# EAGLE design MainsLog-Main (EAGLE 5.11)
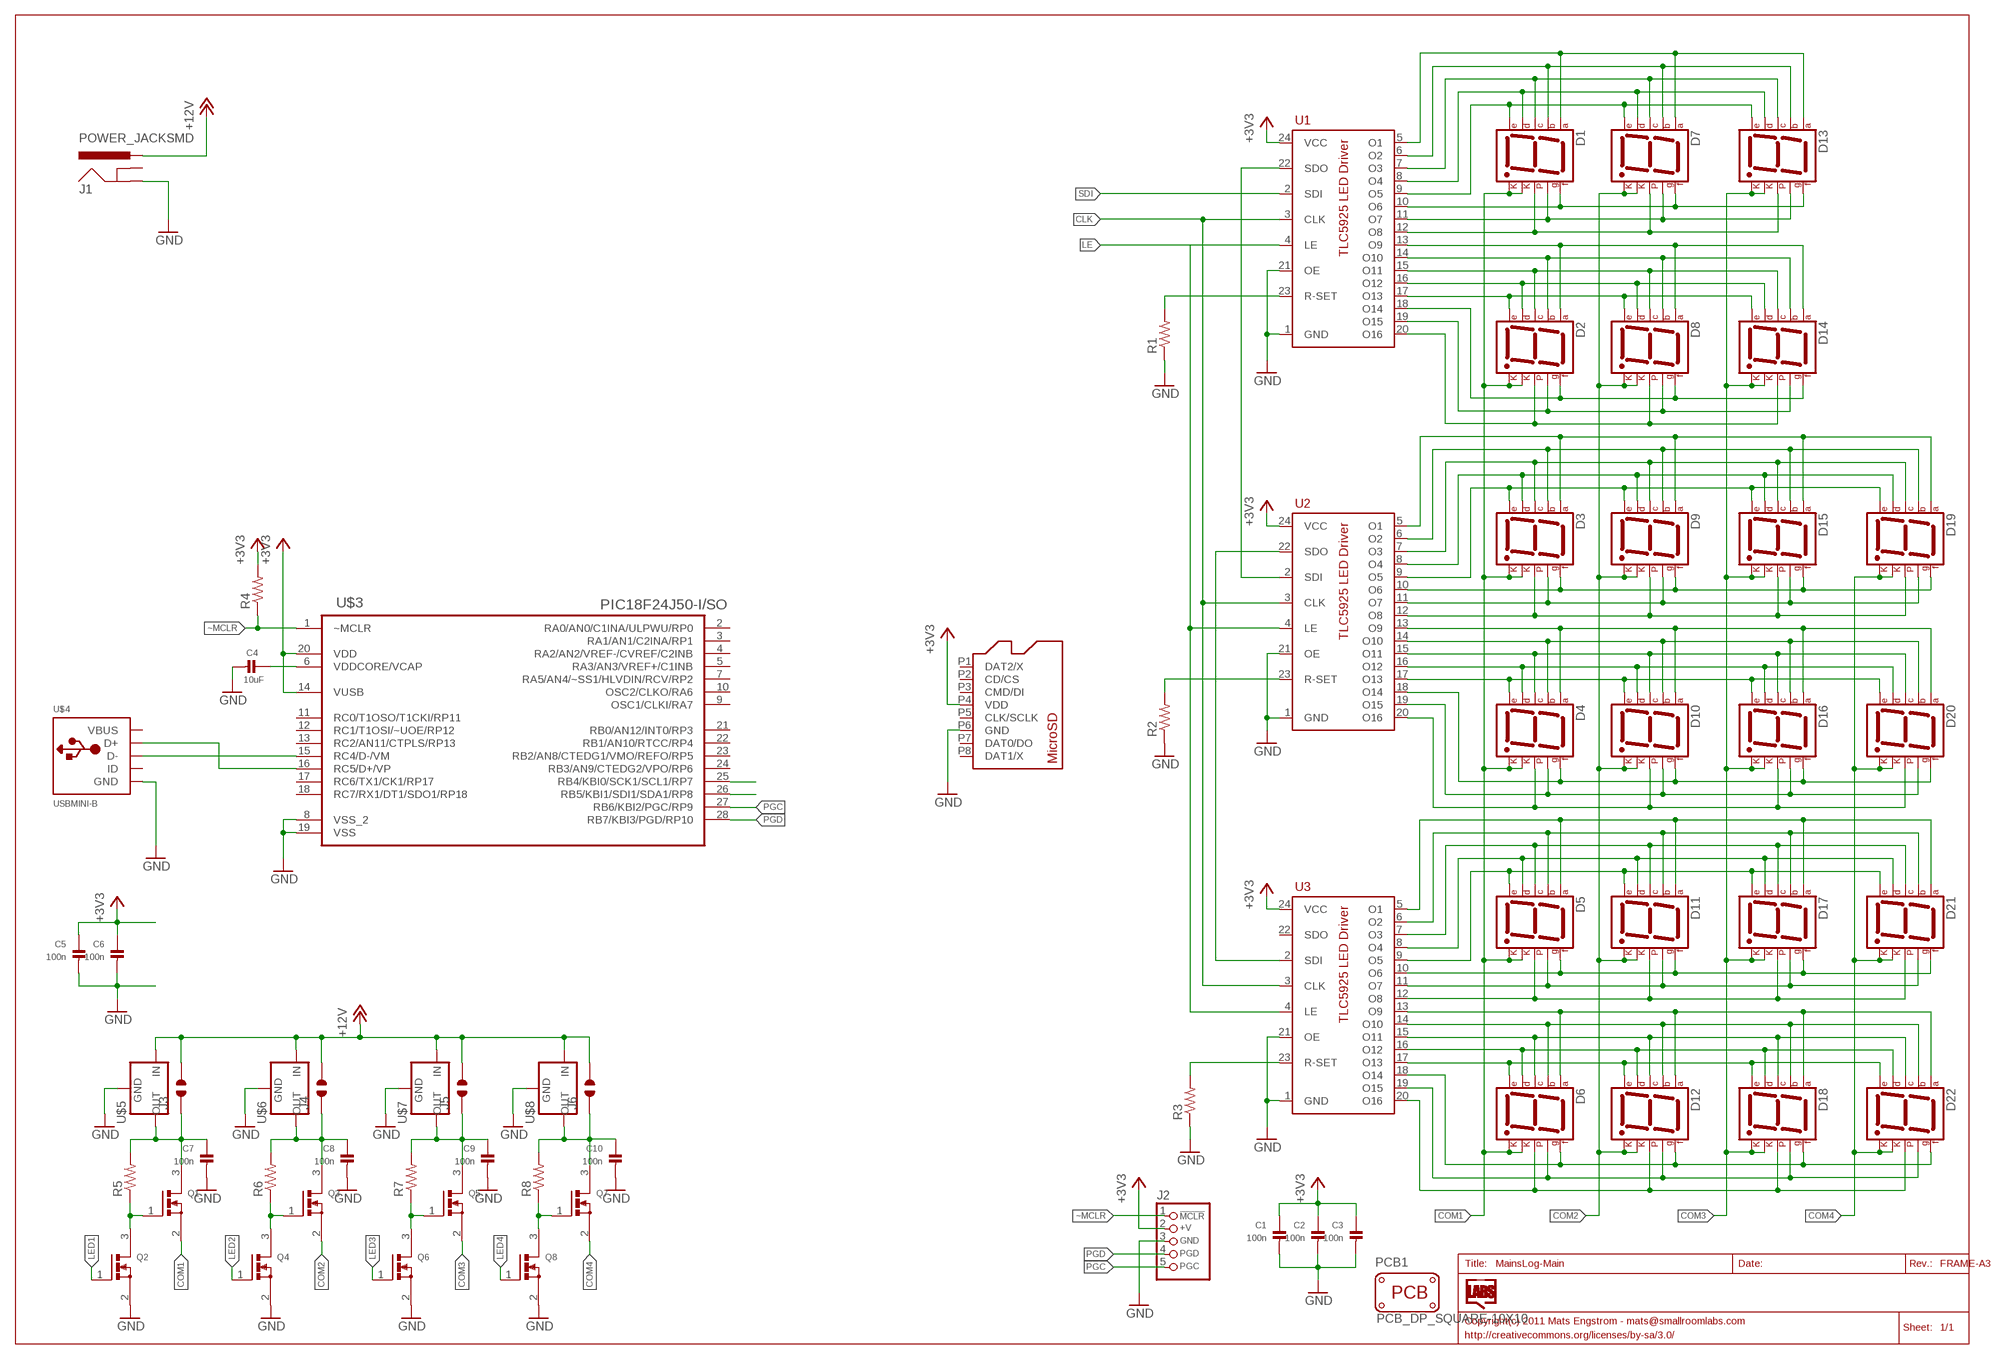
[diagram p0: schematic, sheet 1]

## Parts
C1  100n  CAP_CERAMIC0805  [0805]
C2  100n  CAP_CERAMIC0805  [0805]
C3  100n  CAP_CERAMIC0805  [0805]
C4  10uF  CAP_CERAMIC0805  [0805]
C5  100n  CAP_CERAMIC0805  [0805]
C6  100n  CAP_CERAMIC0805  [0805]
C7  100n  CAP_CERAMIC0805  [0805]
C8  100n  CAP_CERAMIC0805  [0805]
C9  100n  CAP_CERAMIC0805  [0805]
C10  100n  CAP_CERAMIC0805  [0805]
D1  7SEG-CK  [7SEG-13]
D2  7SEG-CK  [7SEG-13]
D3  7SEG-CK  [7SEG-13]
D4  7SEG-CK  [7SEG-13]
D5  7SEG-CK  [7SEG-13]
D6  7SEG-CK  [7SEG-13]
D7  7SEG-CK  [7SEG-13]
D8  7SEG-CK  [7SEG-13]
D9  7SEG-CK  [7SEG-13]
D10  7SEG-CK  [7SEG-13]
D11  7SEG-CK  [7SEG-13]
D12  7SEG-CK  [7SEG-13]
D13  7SEG-CK  [7SEG-13]
D14  7SEG-CK  [7SEG-13]
D15  7SEG-CK  [7SEG-13]
D16  7SEG-CK  [7SEG-13]
D17  7SEG-CK  [7SEG-13]
D18  7SEG-CK  [7SEG-13]
D19  7SEG-CK  [7SEG-13]
D20  7SEG-CK  [7SEG-13]
D21  7SEG-CK  [7SEG-13]
D22  7SEG-CK  [7SEG-13]
J1  POWER_JACKSMD  [POWER_JACK_SMD]
J2  CON_HEADER_PRG_PIC_ICSPB  [HEADER_PRG_1X05_ICSP_B]
J3  JUMPER_SOLDER_1X2  [JUMPER_SOLDER_1X2]
J4  JUMPER_SOLDER_1X2  [JUMPER_SOLDER_1X2]
J5  JUMPER_SOLDER_1X2  [JUMPER_SOLDER_1X2]
J6  JUMPER_SOLDER_1X2  [JUMPER_SOLDER_1X2]
PCB1  PCB_DP_SQUARE-10X10  [PCB10X10]
Q1  MOSFET-NREFLOW  [SOT23-R]
Q2  MOSFET-NREFLOW  [SOT23-R]
Q3  MOSFET-NREFLOW  [SOT23-R]
Q4  MOSFET-NREFLOW  [SOT23-R]
Q5  MOSFET-NREFLOW  [SOT23-R]
Q6  MOSFET-NREFLOW  [SOT23-R]
Q7  MOSFET-NREFLOW  [SOT23-R]
Q8  MOSFET-NREFLOW  [SOT23-R]
R1  RES0805A  [R0805A]
R2  RES0805A  [R0805A]
R3  RES0805A  [R0805A]
R4  10K  RES0805A  [R0805A]
R5  10K  RES0805A  [R0805A]
R6  10K  RES0805A  [R0805A]
R7  10K  RES0805A  [R0805A]
R8  10K  RES0805A  [R0805A]
U1  TLC5925-TSSOP  [TSSOP24]
U2  TLC5925-TSSOP  [TSSOP24]
U3  TLC5925-TSSOP  [TSSOP24]
U$2  MICROSD-DM3D  [DM3D]
U$3  PIC18F24J50-I/SO  [SOIC127P1030X265-28N]
U$4  USBMINI-B  [MOLEX67503]
U$5  V_REG_MIC2920  [SOT223]
U$6  V_REG_MIC2920  [SOT223]
U$7  V_REG_MIC2920  [SOT223]
U$8  V_REG_MIC2920  [SOT223]

## Nets
+3V3: C1.1 C2.1 C3.1 C5.1 C6.1 J2.2(+V) R4.2 U1.24(VCC) U2.24(VCC) U3.24(VCC) U$2.P4(VDD) U$3.14(VUSB) U$3.20(VDD)
+12V: J1.VIN0(PWR) J3.2 J4.2 J5.2 J6.2 U$5.1(IN) U$6.1(IN) U$7.1(IN) U$8.1(IN)
CLK: U1.3(CLK) U2.3(CLK) U3.3(CLK)
COM1: D1.3(CK1) D1.8(CK2) D2.3(CK1) D2.8(CK2) D3.3(CK1) D3.8(CK2) D4.3(CK1) D4.8(CK2) D5.3(CK1) D5.8(CK2) D6.3(CK1) D6.8(CK2) Q1.2(S)
COM2: D7.3(CK1) D7.8(CK2) D8.3(CK1) D8.8(CK2) D9.3(CK1) D9.8(CK2) D10.3(CK1) D10.8(CK2) D11.3(CK1) D11.8(CK2) D12.3(CK1) D12.8(CK2) Q3.2(S)
COM3: D13.3(CK1) D13.8(CK2) D14.3(CK1) D14.8(CK2) D15.3(CK1) D15.8(CK2) D16.3(CK1) D16.8(CK2) D17.3(CK1) D17.8(CK2) D18.3(CK1) D18.8(CK2) Q5.2(S)
COM4: D19.3(CK1) D19.8(CK2) D20.3(CK1) D20.8(CK2) D21.3(CK1) D21.8(CK2) D22.3(CK1) D22.8(CK2) Q7.2(S)
GND: C1.2 C2.2 C3.2 C4.2 C5.2 C6.2 C7.2 C8.2 C9.2 C10.2 J1.P$4(GND) J2.3(GND) Q2.2(S) Q4.2(S) Q6.2(S) Q8.2(S) R1.1 R2.1 R3.1 U1.1(GND) U1.21(OE) U2.1(GND) U2.21(OE) U3.1(GND) U3.21(OE) U$2.P6(GND) U$3.8(VSS_2) U$3.19(VSS) U$4.GND U$5.2(GND) U$6.2(GND) U$7.2(GND) U$8.2(GND)
LE: U1.4(LE) U2.4(LE) U3.4(LE)
LED1: Q2.1(G)
LED2: Q4.1(G)
LED3: Q6.1(G)
LED4: Q8.1(G)
N$1: Q1.1(G) Q2.3(D) R5.1
N$2: C10.1 J6.1 Q7.3(D) R8.2 U$8.3(OUT)
N$3: U1.22(SDO) U2.2(SDI)
N$4: U2.22(SDO) U3.2(SDI)
N$5: U$3.15(RC4/D-/VM) U$4.D-
N$6: U$3.16(RC5/D+/VP) U$4.D+
N$7: R3.2 U3.23(R-SET)
N$8: R2.2 U2.23(R-SET)
N$9: R1.2 U1.23(R-SET)
N$10: U$3.25(RB4/KBI0/SCK1/SCL1/RP7)
N$11: U$3.26(RB5/KBI1/SDI1/SDA1/RP8)
N$12: C8.1 J4.1 Q3.3(D) R6.2 U$6.3(OUT)
N$13: C4.1 U$3.6(VDDCORE/VCAP)
N$16: C9.1 J5.1 Q5.3(D) R7.2 U$7.3(OUT)
N$17: C7.1 J3.1 Q1.3(D) R5.2 U$5.3(OUT)
N$18: Q3.1(G) Q4.3(D) R6.1
N$19: Q5.1(G) Q6.3(D) R7.1
N$20: Q7.1(G) Q8.3(D) R8.1
PGC: J2.5(PGC) U$3.27(RB6/KBI2/PGC/RP9)
PGD: J2.4(PGD) U$3.28(RB7/KBI3/PGD/RP10)
SDI: U1.2(SDI)
SEG-A1: D1.7(A) D7.7(A) D13.7(A) U1.5(O1)
SEG-A2: D2.7(A) D8.7(A) D14.7(A) U1.13(O9)
SEG-A3: D3.7(A) D9.7(A) D15.7(A) D19.7(A) U2.5(O1)
SEG-A4: D4.7(A) D10.7(A) D16.7(A) D20.7(A) U2.13(O9)
SEG-A5: D5.7(A) D11.7(A) D17.7(A) D21.7(A) U3.5(O1)
SEG-A6: D6.7(A) D12.7(A) D18.7(A) D22.7(A) U3.13(O9)
SEG-B1: D1.6(B) D7.6(B) D13.6(B) U1.6(O2)
SEG-B2: D2.6(B) D8.6(B) D14.6(B) U1.14(O10)
SEG-B3: D3.6(B) D9.6(B) D15.6(B) D19.6(B) U2.6(O2)
SEG-B4: D4.6(B) D10.6(B) D16.6(B) D20.6(B) U2.14(O10)
SEG-B5: D5.6(B) D11.6(B) D17.6(B) D21.6(B) U3.6(O2)
SEG-B6: D6.6(B) D12.6(B) D18.6(B) D22.6(B) U3.14(O10)
SEG-C1: D1.4(C) D7.4(C) D13.4(C) U1.7(O3)
SEG-C2: D2.4(C) D8.4(C) D14.4(C) U1.15(O11)
SEG-C3: D3.4(C) D9.4(C) D15.4(C) D19.4(C) U2.7(O3)
SEG-C4: D4.4(C) D10.4(C) D16.4(C) D20.4(C) U2.15(O11)
SEG-C5: D5.4(C) D11.4(C) D17.4(C) D21.4(C) U3.7(O3)
SEG-C6: D6.4(C) D12.4(C) D18.4(C) D22.4(C) U3.15(O11)
SEG-D1: D1.2(D) D7.2(D) D13.2(D) U1.8(O4)
SEG-D2: D2.2(D) D8.2(D) D14.2(D) U1.16(O12)
SEG-D3: D3.2(D) D9.2(D) D15.2(D) D19.2(D) U2.8(O4)
SEG-D4: D4.2(D) D10.2(D) D16.2(D) D20.2(D) U2.16(O12)
SEG-D5: D5.2(D) D11.2(D) D17.2(D) D21.2(D) U3.8(O4)
SEG-D6: D6.2(D) D12.2(D) D18.2(D) D22.2(D) U3.16(O12)
SEG-E1: D1.1(E) D7.1(E) D13.1(E) U1.9(O5)
SEG-E2: D2.1(E) D8.1(E) D14.1(E) U1.17(O13)
SEG-E3: D3.1(E) D9.1(E) D15.1(E) D19.1(E) U2.9(O5)
SEG-E4: D4.1(E) D10.1(E) D16.1(E) D20.1(E) U2.17(O13)
SEG-E5: D5.1(E) D11.1(E) D17.1(E) D21.1(E) U3.9(O5)
SEG-E6: D6.1(E) D12.1(E) D18.1(E) D22.1(E) U3.17(O13)
SEG-F1: D1.9(F) D7.9(F) D13.9(F) U1.10(O6)
SEG-F2: D2.9(F) D8.9(F) D14.9(F) U1.18(O14)
SEG-F3: D3.9(F) D9.9(F) D15.9(F) D19.9(F) U2.10(O6)
SEG-F4: D4.9(F) D10.9(F) D16.9(F) D20.9(F) U2.18(O14)
SEG-F5: D5.9(F) D11.9(F) D17.9(F) D21.9(F) U3.10(O6)
SEG-F6: D6.9(F) D12.9(F) D18.9(F) D22.9(F) U3.18(O14)
SEG-G1: D1.10(G) D7.10(G) D13.10(G) U1.11(O7)
SEG-G2: D2.10(G) D8.10(G) D14.10(G) U1.19(O15)
SEG-G3: D3.10(G) D9.10(G) D15.10(G) D19.10(G) U2.11(O7)
SEG-G4: D4.10(G) D10.10(G) D16.10(G) D20.10(G) U2.19(O15)
SEG-G5: D5.10(G) D11.10(G) D17.10(G) D21.10(G) U3.11(O7)
SEG-G6: D6.10(G) D12.10(G) D18.10(G) D22.10(G) U3.19(O15)
SEG-P1: D1.5(DP) D7.5(DP) D13.5(DP) U1.12(O8)
SEG-P2: D2.5(DP) D8.5(DP) D14.5(DP) U1.20(O16)
SEG-P3: D3.5(DP) D9.5(DP) D15.5(DP) D19.5(DP) U2.12(O8)
SEG-P4: D4.5(DP) D10.5(DP) D16.5(DP) D20.5(DP) U2.20(O16)
SEG-P5: D5.5(DP) D11.5(DP) D17.5(DP) D21.5(DP) U3.12(O8)
SEG-P6: D6.5(DP) D12.5(DP) D18.5(DP) D22.5(DP) U3.20(O16)
~MCLR: J2.1(/MCLR) R4.1 U$3.1(~MCLR)
Unconnected: J1.GND(GNDBREAK) U3.22(SDO) U$2.P1(DAT2/X) U$2.P2(CD/CS) U$2.P3(CMD/DI) U$2.P5(CLK/SCLK) U$2.P7(DAT0/DO) U$2.P8(DAT1/X) U$3.2(RA0/AN0/C1INA/ULPWU/RP0) U$3.3(RA1/AN1/C2INA/RP1) U$3.4(RA2/AN2/VREF-/CVREF/C2INB) U$3.5(RA3/AN3/VREF+/C1INB) U$3.7(RA5/AN4/~SS1/HLVDIN/RCV/RP2) U$3.9(OSC1/CLKI/RA7) U$3.10(OSC2/CLKO/RA6) U$3.11(RC0/T1OSO/T1CKI/RP11) U$3.12(RC1/T1OSI/~UOE/RP12) U$3.13(RC2/AN11/CTPLS/RP13) U$3.17(RC6/TX1/CK1/RP17) U$3.18(RC7/RX1/DT1/SDO1/RP18) U$3.21(RB0/AN12/INT0/RP3) U$3.22(RB1/AN10/RTCC/RP4) U$3.23(RB2/AN8/CTEDG1/VMO/REFO/RP5) U$3.24(RB3/AN9/CTEDG2/VPO/RP6) U$4.ID

## Power pins joined to a net without a drawn wire
VBUS: U$4.VBUS

## Library data of the parts
C1-C10 = microbuilder:CAP_CERAMIC: Ceramic Capacitors 0402 - 0402 Surface Mount Capacitors 0.1uF 10V 10% [Digikey: 490-1318-2-ND] 0603 - 0603 Surface Mount Capacitors 16 pF 50V 5% [Digikey: 445-5051-2-ND] 22 pF 50V [Digikey: PCC220ACVTR-ND] 33 pF 50V 5% [Digikey: 490-1415-1-ND] 56pF 50V 5% [Digikey: 490-1421-1-ND] 220pF 50V 5% [Digikey: 445-1285-1-ND] 680 pF 50V 2200 pF 50V 5% C0G [Digikey: 445-1297-1-ND] 5600 pF 100V 5% X7R [Digikey: 478-3711-1-ND] 0.1 µF 25V 10% [Digikey: PCC2277TR-ND] 0.22 µF 16V 10% X7R [Digikey: 445-1318-1-ND] 1.0 µF 25V 10% [Digikey: 445-5146-2-ND] 0603 - RF Specific 3pF 250V +/-0.1pF RF [Digikey: 712-1347-1-ND] 18 pF 250V 5% [Digikey: 478-3505-1-ND or 712-1322-1-ND] 56 pF 250V 5% C0G RF [Digikey: 490-4867-1-ND] 68 pF 250V RF [Digikey: 490-4868-1-ND] 0805 - 0805 Surface Mount Capacitors 220 pF 250V 2% RF Ceramic Capacitor [Digikey: 712-1398-1-ND] 1000 pF 50V 2% NP0 Ceramic Capacitor [Digikey: 478-3760-1-ND] 0.1 µF 25V 10% Ceramic Capacitor [Digikey: PCC1828TR-ND] 1.0 µF 16V 10% Ceramic Capacitor[Digikey: 490-1691-2-ND] 10.0 µF 10V 10% Ceramic Capacitor[Digikey: 709-1228-1-ND] 1206 - 1206 Surface Mount Capacitors
D1-D22 = special:7SEG-CK: 7-segment DISPLAY single cathode, 13 mm
J1 = SparkFun:POWER_JACK: Power Jack This is the standard 5.5mm barrel jack for power. The PTH is the most common, proven, reliable, footprint. All others are experimental. The Slot footprint only works if the mill layer is transmitted to the PCB fab house so be warned. Spark Fun Electronics SKU : PRT-00119. Mating wall wart : TOL-00298 (and others)
J2 = dp_devices:CON_HEADER_PRG_PIC_ICSP: 5-pin PIC In Circuit Serial Programming header
J3-J6 = dp_devices:JUMPER_SOLDER_1X2
PCB1 = dp_devices:PCB_DP_SQUARE: Dangerous Prototypes Standard Square PCB sizes
Q1-Q8 = microbuilder:MOSFET-N: N-Channel Mosfet Digikey: 2N7002ET1GOSTR-ND
R1-R8 = SmallRoomLabs:RES
U1-U3 = SmallRoomLabs:TLC5925
U$2 = SmallRoomLabs:MICROSD
U$3 = SmallRoomLabs:PIC18F24J50-I/SO: High-Performance Enhanced Flash Microcontrollers; MPN: PIC18F24J50-I/SO; OC_FARNELL: 1778466; OC_NEWARK: 98M1772; PACKAGE: SOIC-28; SUPPLIER: Microchip
U$4 = SmallRoomLabs:USB
U$5-U$8 = SparkFun:V_REG_MIC2920: MIC2920A (http://www.micrel.com/_PDF/mic2920.pdf) - 400mA output LDO Regulator

## Net classes
0 default: width 0.203 mm, drill 0.305 mm, clearance 0.203 mm

## Board
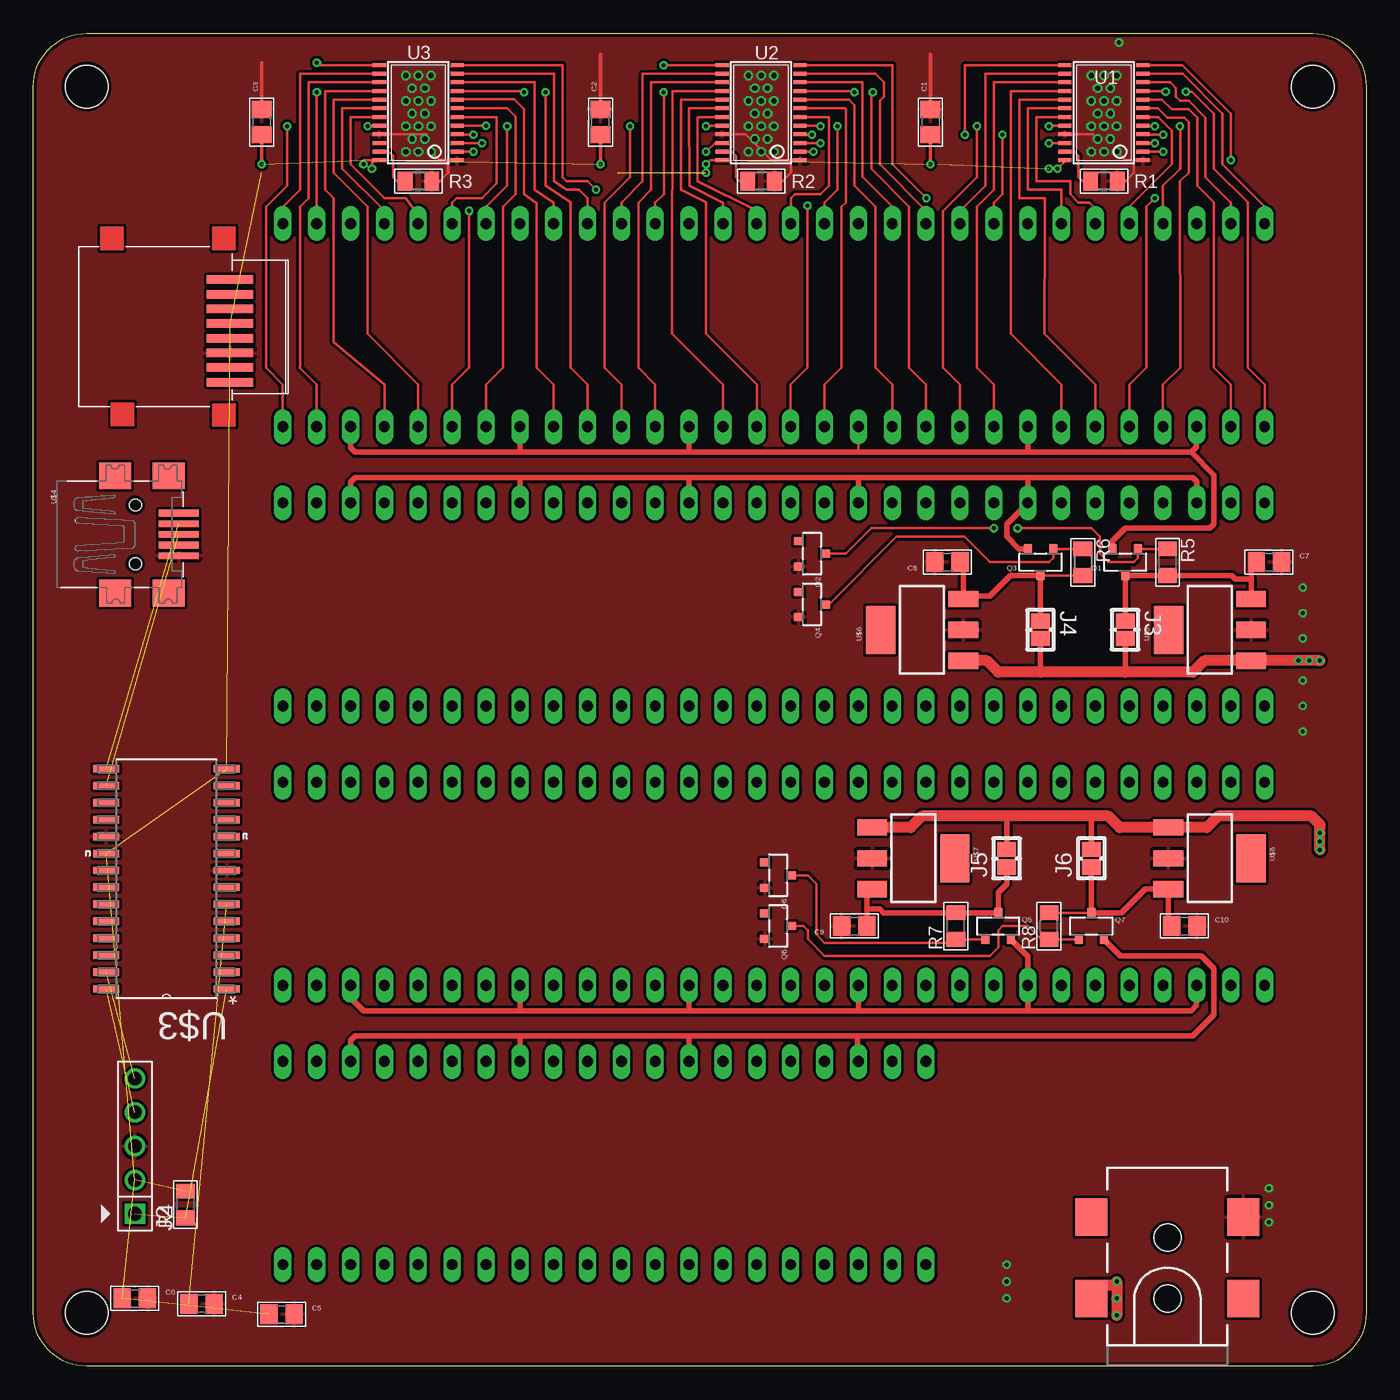
[diagram p1: board, top side]
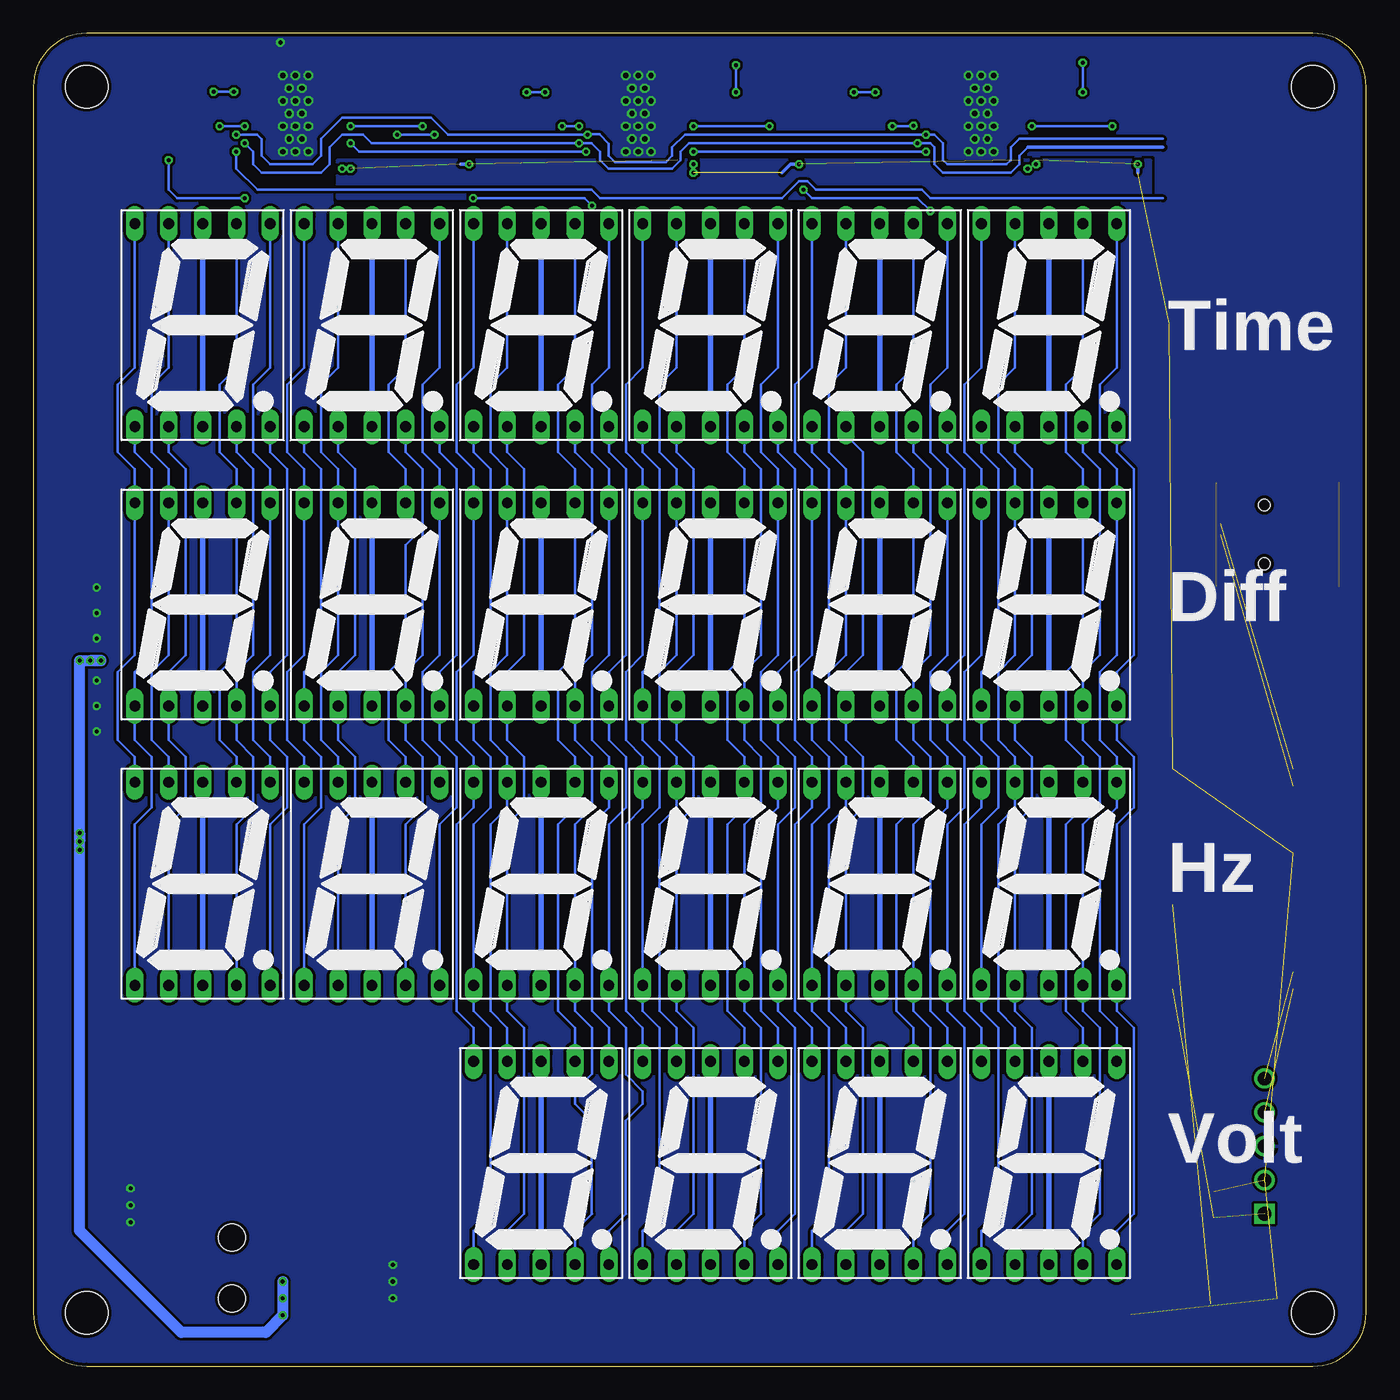
[diagram p2: board, bottom side, seen from below]

Size 100 x 100 mm. Coordinates in mm from the lower left corner, seen from the top.
Copper layers (1*16): Top 0.035mm / dielectric 1.5mm / Bottom 0.035mm
Design rules "Fusion_eagle_rule_v1.1": minimum track width 6mil, minimum drill 12mil, track to track 6mil, track to pad 6mil, pad to pad 6mil, via to via 6mil, smd to smd 0mil, copper to edge 10mil, drill to drill 10mil, minimum pad ring 10mil, minimum via ring 6mil, stop-mask expansion 2mil, vias tented up to drill 100mil, thermal gap 10mil

### Footprints (pad centres in the part's own frame; a part is rotated, then mirrored left to right if it is on the bottom)
0805 = smd 1.3 x 1.5: 1 -0.95,0; 2 0.95,0
7SEG-13 = drill 0.813 long: 1 -5.08,-7.62; 2 -2.54,-7.62; 3 0,-7.62; 4 2.54,-7.62; 5 5.08,-7.62; 6 5.08,7.62; 7 2.54,7.62; 8 0,7.62; 9 -2.54,7.62; 10 -5.08,7.62
POWER_JACK_SMD = smd 2.8 x 2.4: GND 0,-5.7; P$4 6.1,-5.7; VIN0 0,5.7; VIN1 6.1,5.7 | hole 2.032: 0,0; 4.572,0
HEADER_PRG_1X05_ICSP_B = drill 1.016 square: 1 -5.08,0 | drill 1.016 round: 2 -2.54,0; 3 0,0; 4 2.54,0; 5 5.08,0
JUMPER_SOLDER_1X2 = smd 1.143 x 1.422: 1 -0.66,0; 2 0.66,0
PCB10X10 = hole 3.2: 4,4; 96,4; 96,96; 4,96
SOT23-R = smd 0.6 x 0.7: 1 -0.95,-1; 2 0.95,-1; 3 0,1
R0805A = smd 1.1 x 1.4: 1 -1,0; 2 1,0
TSSOP24 = smd 0.305 x 0.991: 1 -3.575,-2.918; 2 -2.925,-2.918; 3 -2.275,-2.918; 4 -1.625,-2.918; 5 -0.975,-2.918; 6 -0.325,-2.918; 7 0.325,-2.918; 8 0.975,-2.918; 9 1.625,-2.918; 10 2.275,-2.918; 11 2.925,-2.918; 12 3.575,-2.918; 13 3.575,2.918; 14 2.925,2.918; 15 2.275,2.918; 16 1.625,2.918; 17 0.975,2.918; 18 0.325,2.918; 19 -0.325,2.918; 20 -0.975,2.918; 21 -1.625,2.918; 22 -2.275,2.918; 23 -2.925,2.918; 24 -3.575,2.918
DM3D = smd 0.635 x 3.5: P1 9.544,0.168; P2 8.444,0.168; P3 7.344,0.168; P4 6.244,0.168; P5 5.144,0.168; P6 4.044,0.168; P7 2.944,0.168; P8 1.844,0.168
SOIC127P1030X265-28N = smd 1.981 x 0.559: 1 -4.521,8.255; 2 -4.521,6.985; 3 -4.521,5.715; 4 -4.521,4.445; 5 -4.521,3.175; 6 -4.521,1.905; 7 -4.521,0.635; 8 -4.521,-0.635; 9 -4.521,-1.905; 10 -4.521,-3.175; 11 -4.521,-4.445; 12 -4.521,-5.715; 13 -4.521,-6.985; 14 -4.521,-8.255; 15 4.521,-8.255; 16 4.521,-6.985; 17 4.521,-5.715; 18 4.521,-4.445; 19 4.521,-3.175; 20 4.521,-1.905; 21 4.521,-0.635; 22 4.521,0.635; 23 4.521,1.905; 24 4.521,3.175; 25 4.521,4.445; 26 4.521,5.715; 27 4.521,6.985; 28 4.521,8.255
MOLEX67503 = smd 0.5 x 3: D+ 0,3.264; D- -0.8,3.264; GND 1.6,3.264; ID 0.8,3.264; VBUS -1.6,3.264 | smd 2 x 2.4: GND1 -4.4,-1.5; GND2 -4.4,2.5; GND3 4.4,2.5; GND4 4.4,-1.5 | hole 0.9: -2.2,0; 2.2,0
SOT223 = smd 1.219 x 2.235: 1 -2.311,-3.099; 2 0,-3.099; 3 2.311,-3.099 | smd 3.6 x 2.2: 4 0,3.099

### Placement (x,y rotation side)
C1  67.31,93.34 90 top
C2  42.55,93.34 90 top
C3  17.14,93.34 90 top
C4  12.62,4.7 0 top
C5  18.62,3.89 0 top
C6  7.62,5.08 0 top
C7  92.71,60.33 0 top
C8  68.58,60.33 180 top
C9  61.59,33.02 180 top
C10  86.36,33.02 0 top
D1  87.3,78.11 0 bottom
D2  74.6,78.11 0 bottom
D3  61.9,78.11 0 bottom
D4  49.2,78.11 0 bottom
D5  36.5,78.11 0 bottom
D6  23.8,78.11 0 bottom
D7  87.3,57.15 0 bottom
D8  74.6,57.15 0 bottom
D9  61.9,57.15 0 bottom
D10  49.2,57.15 0 bottom
D11  36.5,57.15 0 bottom
D12  23.8,57.15 0 bottom
D13  87.3,36.2 0 bottom
D14  74.6,36.2 0 bottom
D15  61.9,36.2 0 bottom
D16  49.2,36.2 0 bottom
D17  36.5,36.2 0 bottom
D18  23.8,36.2 0 bottom
D19  61.9,15.24 0 bottom
D20  49.2,15.24 0 bottom
D21  36.5,15.24 0 bottom
D22  23.8,15.24 0 bottom
J1  85.09,5.08 90 top
J2  7.62,16.51 90 top
J3  81.92,55.24 270 top
J4  75.56,55.24 270 top
J5  73.03,38.1 90 top
J6  79.38,38.1 90 top
PCB1  100,0 0 bottom
Q1  81.92,60.33 180 top
Q2  58.42,60.96 270 top
Q3  75.56,60.33 180 top
Q4  58.42,57.15 270 top
Q5  72.39,33.02 0 top
Q6  55.88,36.83 270 top
Q7  79.38,33.02 0 top
Q8  55.88,33.02 270 top
R1  80.33,88.9 180 top
R2  54.61,88.9 180 top
R3  28.89,88.9 180 top
R4  11.42,12.13 90 top
R5  85.09,60.33 270 top
R6  78.74,60.33 270 top
R7  69.22,33.02 90 top
R8  76.2,33.02 90 top
U1  80.31,94.04 90 top
U2  54.6,94.04 90 top
U3  28.88,94.04 90 top
U$2  14.92,71.98 90 top
U$3  9.99,36.56 180 top
U$4  7.65,62.41 270 top
U$5  88.27,55.24 90 top
U$6  66.67,55.24 90 top
U$7  66.04,38.1 270 top
U$8  88.27,38.1 270 top
U$9  [SRL-LOGO-BSTOP-10MM]  86.36,8.89 0 top

### Tracks (layer width: path | path; a pad name or v marks a point on that pad's centre or on a via)
+3V3  (via drill 0.3)  (12 unrouted)
  Top 0.203: U3.24 25.42,90.47 25.4,90.45 | 25.4,90.45 v25.4,89.85 | v24.77,90.17 24.77,90.49 25.36,90.49 25.4,90.45 | v50.48,89.53 v50.48,90.17 50.8,90.49 51.66,90.49 U2.24 | U1.24 77.49,90.47 v76.83,89.85 v76.2,89.85
  Top 0.254: v67.31,90.17 C1.1 | v42.55,90.17 C2.1 | v17.14,90.17 C3.1
  Bottom 0.254: v67.31,90.17 67.94,90.17 | v42.55,90.17 43.18,90.17 43.81,89.53 | v17.14,90.17 17.14,89.53
+12V  (via drill 0.3)
  Top 0.406: 81.92,52.07 J3.2 | 75.56,52.07 J4.2 | 79.38,41.27 J6.2 | 73.03,41.27 J5.2
  Top 0.813: U$6.1 71.53,52.93 72.39,52.07 75.56,52.07 81.92,52.07 87,52.07 87.86,52.93 U$5.1 v96.52,52.93 | 62.87,40.49 U$7.1 65.81,40.41 66.67,41.27 73.03,41.27 79.38,41.27 80.64,41.27 81.51,40.41 U$8.1 88.04,40.41 88.9,41.27 95.89,41.27 96.52,40.64 v96.52,40.01 | J1.VIN0 79.38,6.09 81.28,6.09 v81.28,6.35 v81.28,5.08 v81.28,3.81 | v96.52,38.73 v96.52,40.01 | v96.52,40.01 96.52,40.41
  Bottom 0.813: v81.28,6.35 v81.28,3.81 82.55,2.54 88.9,2.54 96.52,10.16 v96.52,38.73 v96.52,39.37 | v96.52,39.37 v96.52,52.93 94.93,52.94 v94.92,52.95 v95.72,52.93 | v96.52,40.01 v96.52,39.37
CLK  (via drill 0.3)
  Top 0.203: U2.3 59.16,91.77 v59.05,91.76 | U3.3 31.81,91.76 v33.66,91.76 | U1.3 84.13,91.77 v84.14,91.76
  Bottom 0.203: v84.14,91.76 83.5,91.12 83.5,90.17 82.87,89.53 78.42,89.53 77.79,90.17 77.79,91.44 76.83,92.39 75.25,92.39 74.61,91.76 v59.05,91.76 58.1,91.76 57.47,91.12 57.47,90.49 56.83,89.85 52.07,89.85 51.44,90.49 51.44,91.12 50.8,91.76 v33.66,91.76 32.7,91.76 32.38,91.44 32.38,90.17 31.75,89.53 26.67,89.53 26.04,90.17 26.04,90.81 25.4,91.44
  Bottom 0.254: 15.24,91.44 25.4,91.44
COM1
  Top 0.203: 87.25,70.43 D1.3 | 74.55,68.58 74.6,68.63 | 36.58,68.58 36.5,68.66 | 61.9,68.58 D3.3
  Top 0.406: 49.2,68.58 36.58,68.58 24.13,68.58 23.8,68.91 D6.3 | 86.87,68.58 74.55,68.58 61.9,68.58 49.2,68.58 | 86.87,68.58 87.25,68.96 87.25,70.43 | 74.6,68.63 D2.3 | 36.5,68.66 D5.3 | 49.2,68.58 D4.3 | 86.87,68.58 88.58,66.86 88.58,63.18 88.27,62.87 81.92,62.87 80.97,61.91 Q1.2
  Bottom 0.406: D6.3 D6.8 | D5.3 D5.8 | D4.3 D4.8 | D3.3 D3.8 | D2.3 D2.8 | D1.3 D1.8
COM2
  Top 0.406: D12.8 23.8,66.34 24.13,66.67 36.5,66.67 | 49.2,66.67 61.9,66.67 | 74.6,66.67 87,66.67 87.3,66.37 D7.8 | 74.6,66.67 D8.8 | 61.9,66.67 D9.8 | 61.9,66.67 74.6,66.67 | 49.2,66.67 D10.8 | 36.5,66.67 D11.8 | 36.5,66.67 49.2,66.67 | D8.8 74.61,64.75 | Q3.2 73.93,61.33 73.03,62.23 73.03,63.2 D8.8
  Bottom 0.406: D12.3 D12.8 | D11.8 D11.3 | D10.8 D10.3 | D9.8 D9.3 | D8.8 D8.3 | D7.8 D7.3
COM3
  Top 0.203: 87.25,28.52 D13.3 | 74.55,26.67 74.6,26.72 | 36.45,26.67 36.5,26.72
  Top 0.406: 49.2,26.67 36.45,26.67 24.77,26.67 23.8,27.64 D18.3 | 87.25,28.52 87.25,27.05 86.87,26.67 74.55,26.67 61.9,26.67 | 74.6,26.72 D14.3 74.6,30.76 Q5.2 | 36.5,26.72 D17.3 | 61.9,26.67 D15.3 | 49.2,26.67 D16.3 | 49.2,26.67 61.9,26.67
  Bottom 0.406: D13.3 D13.8 | D14.3 D14.8 | D15.3 D15.8 | D16.3 D16.8 | D17.3 D17.8 | D18.3 D18.8
COM4
  Top 0.203: 49.28,24.77 49.2,24.69 | 36.58,24.77 36.5,24.69
  Top 0.406: D22.8 23.8,24.43 24.13,24.77 36.58,24.77 49.28,24.77 61.78,24.77 | 61.78,24.77 61.85,24.38 61.85,22.91 D19.8 | 49.2,24.69 D20.8 | 36.5,24.69 D21.8 | Q7.2 81.55,30.8 87.63,30.8 88.58,29.84 88.58,26.35 87,24.77 61.78,24.77
  Bottom 0.406: D22.3 D22.8 | D21.8 D21.3 | D20.8 D20.3 | D19.8 D19.3
GND  (via drill 0.3, 0.4)
  Top 0.203: U2.21 53.43,92.42 55.38,90.47 56.83,90.47 | 56.83,90.47 U2.1 | R2.1 56.2,88.9 56.83,89.53 56.83,90.47 | R3.1 30.48,88.9 31.11,89.53 | 30.5,90.47 v29.84,91.12 | U3.21 29.5,92.42 v29.37,92.08 | U1.21 79.51,92.42 v79.85,92.08 | 82.55,90.47 U1.1 | 82.55,90.47 81.93,90.47 v81.28,91.12 | R1.1 81.92,88.9 82.55,89.53 82.55,90.47
  Top 0.254: C3.2 17.14,97.79 | C2.2 42.55,98.42 | C1.2 67.31,98.42 | 31.11,90.47 30.5,90.47 | 31.11,90.47 U3.1 | 31.11,89.53 31.11,90.47
  other vias: 95.25,51.44 95.25,54.61 95.25,56.52 95.25,58.42 95.25,49.53 81.46,99.31 27.94,96.84 28.89,96.84 29.84,96.84 28.42,95.89 29.37,95.89 29.84,94.93 28.89,94.93 27.94,94.93 28.42,93.98 29.37,93.98 29.84,93.03 28.89,93.03 27.94,93.03 28.42,92.08 28.89,91.12 27.94,91.12 53.66,96.84 54.61,96.84 55.56,96.84 54.13,95.89 55.09,95.89 55.56,94.93 54.61,94.93 53.66,94.93 54.13,93.98 55.09,93.98 55.56,93.03 54.61,93.03 53.66,93.03 54.13,92.08 55.09,92.08 55.56,91.12 54.61,91.12 53.66,91.12 79.38,96.84 80.33,96.84 81.28,96.84 79.85,95.89 80.8,95.89 81.28,94.93 80.33,94.93 79.38,94.93 79.85,93.98 80.8,93.98 81.28,93.03 80.33,93.03 79.38,93.03 80.8,92.08 80.33,91.12 79.38,91.12 95.25,47.62 73.03,7.62 73.03,6.35 73.03,5.08 92.71,10.79 92.71,12.06 92.71,13.34
  pour Top: 100,100 0,100 0,0 100,0
  pour Top: 82.09,90.55 78.54,90.55 78.54,98.62 82.09,98.62
  pour Top: 52.82,90.23 56.38,90.23 56.38,98.62 52.82,98.62
  pour Top: 27.1,90.23 30.66,90.23 30.66,99.57 27.1,99.57
  pour Bottom (rank 2): 0,100 0,0 100,0 100,100 39.37,100.33
LE  (via drill 0.3)
  Top 0.203: U3.4 31.82,92.39 v33.02,92.39 | v84.77,92.39 83.23,92.39 U1.4 | v58.42,92.39 57.54,92.39 U2.4
  Bottom 0.203: v84.77,92.39 83.21,92.39 82.87,92.05 82.87,90.81 82.23,90.17 79.06,90.17 78.42,90.81 78.42,92.08 76.83,93.66 70.17,93.66 68.9,92.39 v58.42,92.39 58.39,92.42 U2.4 56.83,91.74 56.83,90.81 56.36,90.33 52.55,90.33 52.07,90.81 52.07,91.44 51.12,92.39 v33.02,92.39 32.38,92.39 31.75,91.76 31.75,90.49 31.43,90.17 26.99,90.17 26.67,90.49 26.67,91.44 26.04,92.08 15.24,92.08
N$1  (via drill 0.3)
  Top 0.203: R5.1 Q1.1 82.86,60.64 82.55,60.33 80.64,60.33 80.01,60.96 80.01,62.23 79.38,62.87 v73.85,62.87 | v72.07,62.87 62.87,62.87 60.96,60.96 Q2.3
  Bottom 0.203: v72.07,62.87 v73.85,62.87
N$2
  Top 0.203: R8.2 Q7.3
  Top 0.406: J6.1 Q7.3 81.64,34.02 83.41,35.79 U$8.3 85.17,33.26 C10.1
N$3  (via drill 0.3)
  Top 0.203: U2.2 v58.53,91.12 58.42,91.12 | U1.22 76.53,91.77 v76.2,91.76
  Bottom 0.203: v76.2,91.76 75.56,91.12 74.93,91.12 v58.53,91.12
N$4  (via drill 0.3)
  Top 0.203: U3.2 v33.02,91.12 | v50.48,91.12 51.13,91.77 U2.22
  Bottom 0.203: v33.02,91.12 v50.48,91.12
N$5  (1 unrouted)
N$6  (1 unrouted)
N$7
  Top 0.203: U3.23 26.67,91.12 26.99,90.81 26.99,89.22 27.3,88.9 R3.2
N$8
  Top 0.203: U2.23 52.39,91.12 52.7,90.81 52.7,89.22 53.02,88.9 R2.2
N$9
  Top 0.203: U1.23 78.11,91.12 78.42,90.81 78.42,89.22 78.74,88.9 R1.2 79.38,88.9
N$12
  Top 0.203: Q3.3 R6.2 | U$6.3 70,57.78
  Top 0.406: U$6.3 69.77,60.09 C8.1 | 70,57.78 71.75,57.78 73.3,59.33 Q3.3 J4.1
N$13  (1 unrouted)
N$16
  Top 0.406: J5.1 73.03,36.2 72.39,35.56 Q5.3 R7.2 63.77,34.02 63.5,34.29 62.55,34.29 | 62.55,34.29 62.55,35.39 U$7.3 | C9.1 62.55,34.29
N$17
  Top 0.406: 91.36,59.05 U$5.3 | 91.36,59.05 91.36,60.09 C7.1 | 91.36,59.05 90.17,59.05 89.9,59.33 R5.2 Q1.3 J3.1
N$18
  Top 0.203: R6.1 Q3.1 76.52,60.64 76.2,60.33 71.75,60.33 69.85,62.23 64.77,62.23 59.69,57.15 Q4.3
N$19
  Top 0.203: 71.44,32.07 Q5.1 R7.1 68.94,31.75 59.37,31.75 58.74,32.38 58.74,36.2 58.1,36.83 Q6.3
N$20
  Top 0.203: 78.42,32.07 Q7.1 R8.1 75.61,32.02 74.61,33.02 72.71,33.02 72.39,32.7 72.39,31.43 71.75,30.8 59.37,30.8 58.1,32.07 58.1,32.7 57.78,33.02 Q8.3
PGC  (1 unrouted)
PGD  (1 unrouted)
SDI  (via drill 0.3)
  Top 0.203: U1.2 v84.77,91.12
  Bottom 0.203: v84.77,91.12 84.77,89.85 83.19,88.27 58.1,88.27 57.47,87.63 43.81,87.63 42.55,88.9 41.91,88.9 41.27,88.27 33.34,88.27 32.7,87.63 15.24,87.63
SEG-A1  (via drill 0.3)
  Top 0.203: v84.14,93.03 83.23,93.03 U1.5 | D1.7 84.76,88.57 86.04,89.85 86.04,93.02 v86.03,93.03
  Bottom 0.203: D13.7 84.76,45.72 86.03,46.99 86.03,52.07 84.76,53.34 D7.7 84.76,67.31 86.03,68.58 86.03,73.66 84.76,74.93 D1.7 | v86.03,93.03 v84.14,93.03
SEG-A2  (via drill 0.3)
  Top 0.203: U1.13 69.9,97.62 v69.9,92.39 | v72.71,92.39 72.71,87.95 72.07,87.31 72.07,85.74 D2.7
  Bottom 0.203: D14.7 72.06,45.72 73.33,46.99 73.33,52.07 72.06,53.34 72.07,53.35 72.07,61.59 71.44,62.23 71.44,63.5 72.06,64.12 D8.7 72.06,67.31 73.33,68.58 73.33,73.66 72.06,74.93 D2.7 | v72.71,92.39 v69.9,92.39
SEG-A3  (via drill 0.3)
  Top 0.203: U2.5 59.05,93.07 v59.05,93.03 | D3.7 59.37,85.74 59.37,87.31 60.33,88.27 v60.33,93.03
  Bottom 0.203: D19.7 59.36,25.4 60.63,26.67 60.63,40.64 59.36,41.91 D15.7 59.36,45.72 60.63,46.99 60.63,52.07 59.36,53.34 D9.7 59.36,67.31 60.63,68.58 60.63,73.66 59.36,74.93 D3.7 | v60.33,93.03 v59.05,93.03
SEG-A4  (via drill 0.3)
  Top 0.203: v47.3,97.62 U2.13 | D4.7 46.66,87.3 47.31,87.95 47.31,95.56 v47.3,95.57
  Bottom 0.203: D4.7 46.66,74.93 47.93,73.66 47.93,68.58 46.66,67.31 D10.7 46.66,53.34 47.93,52.07 47.93,46.99 46.66,45.72 D16.7 46.66,41.91 47.93,40.64 47.93,26.67 46.66,25.4 D20.7 | v47.3,95.57 v47.3,97.62
SEG-A5  (via drill 0.3)
  Top 0.203: v33.96,93.07 U3.5 | v35.56,93.03 35.56,88.58 33.96,87 D5.7
  Bottom 0.203: D5.7 33.96,74.93 35.23,73.66 35.23,68.58 33.96,67.31 D11.7 33.96,53.34 35.23,52.07 35.23,46.99 33.96,45.72 D17.7 33.96,41.91 35.23,40.64 35.23,26.67 33.96,25.4 D21.7 | v33.96,93.07 33.96,93.03 v35.56,93.03
SEG-A6  (via drill 0.3)
  Top 0.203: D6.7 21.26,87.3 21.27,87.95 v21.27,95.57 | v21.27,97.79 21.44,97.62 U3.13
  Bottom 0.203: D6.7 21.26,74.93 22.53,73.66 22.53,68.58 21.26,67.31 D12.7 21.26,53.34 22.53,52.07 22.53,46.99 21.26,45.72 D18.7 21.26,41.91 22.53,40.64 22.53,26.67 21.26,25.4 D22.7 | v21.27,95.57 v21.27,97.79
SEG-B1
  Top 0.203: D1.6 82.22,86.98 85.41,90.17 85.41,92.71 84.4,93.72 U1.6
  Bottom 0.203: D13.6 82.22,45.72 83.49,46.99 83.49,52.07 82.22,53.34 D7.6 82.22,67.31 83.49,68.58 83.49,73.66 82.22,74.93 D1.6
SEG-B2
  Top 0.203: U1.14 71.44,96.97 71.44,88.58 69.52,86.67 D2.6
  Bottom 0.203: D14.6 69.52,45.72 70.79,46.99 70.79,52.07 69.52,53.34 D8.6 69.52,67.31 70.79,68.58 70.79,73.66 69.52,74.93 D2.6
SEG-B3
  Top 0.203: U2.6 59.69,93.72 59.69,88.58 59.05,87.95 57.15,87.95 56.83,87.63 56.83,85.74 D3.6
  Bottom 0.203: D19.6 56.82,25.4 58.09,26.67 58.09,40.64 56.82,41.91 D15.6 56.82,45.72 58.09,46.99 58.09,52.07 56.82,53.34 D9.6 56.82,67.31 58.09,68.58 58.09,73.66 56.82,74.93 D3.6
SEG-B4
  Top 0.203: U2.14 45.72,96.97 45.72,88.9 44.12,87.3 D4.6
  Bottom 0.203: D4.6 44.12,74.93 45.39,73.66 45.39,68.58 44.12,67.31 D10.6 44.12,53.34 45.39,52.07 45.39,46.99 44.12,45.72 D16.6 44.12,41.91 45.39,40.64 45.39,26.67 44.12,25.4 D20.6
SEG-B5
  Top 0.203: U3.6 34.77,93.72 34.77,89.53 34.77,88.74 33.66,87.63 31.75,87.63 31.43,87.31 31.43,85.74 D5.6
  Bottom 0.203: D5.6 31.42,74.93 32.69,73.66 32.69,68.58 31.42,67.31 D11.6 31.42,53.34 32.69,52.07 32.69,46.99 31.42,45.72 D17.6 31.42,41.91 32.69,40.64 32.69,26.67 31.42,25.4 D21.6
SEG-B6
  Top 0.203: D6.6 18.73,85.74 18.73,87 20,88.27 20,96.97 U3.14
  Bottom 0.203: D6.6 18.72,74.93 19.99,73.66 19.99,68.58 18.72,67.31 D12.6 18.72,53.34 19.99,52.07 19.99,46.99 18.72,45.72 D18.6 18.72,41.91 19.99,40.64 19.99,26.67 18.72,25.4 D22.6
SEG-C1
  Top 0.203: D1.4 84.76,73.66 86.04,74.92 86.03,88.89 86.68,89.53 86.68,93.34 86.36,93.66 85.09,93.66 84.38,94.37 U1.7
  Bottom 0.203: D13.4 84.76,40.64 83.49,41.91 83.49,45.72 84.76,46.99 D7.4 84.76,52.07 83.49,53.34 83.49,67.31 84.76,68.58 D1.4
SEG-C2
  Top 0.203: D2.4 72.06,73.66 70.79,74.93 70.79,86.98 72.07,88.27 72.07,96.32 U1.15
  Bottom 0.203: D14.4 72.06,40.64 70.79,41.91 70.79,45.72 72.06,46.99 D8.4 72.06,52.07 70.79,53.34 70.79,67.31 72.06,68.58 D2.4
SEG-C3
  Top 0.203: D3.4 59.36,73.66 60.63,74.93 60.63,86.98 60.96,87.31 60.96,94.3 60.89,94.37 U2.7
  Bottom 0.203: D3.4 59.36,68.58 58.09,67.31 58.09,53.34 59.36,52.07 D9.4 59.36,46.99 58.09,45.72 58.09,41.91 59.36,40.64 D15.4 59.36,26.67 58.09,25.4 58.09,21.92 59.37,20.64 59.37,19.68 58.1,18.41 58.1,11.44 58.09,11.43 59.36,10.16 D19.4
SEG-C4
  Top 0.203: D4.4 46.66,73.66 45.39,74.93 45.39,87.3 46.35,88.27 46.35,96.32 U2.15
  Bottom 0.203: D4.4 46.66,68.58 45.39,67.31 45.39,53.34 46.66,52.07 D10.4 46.66,46.99 45.39,45.72 45.39,41.91 46.66,40.64 D16.4 46.66,26.67 45.39,25.4 45.39,11.43 46.66,10.16 D20.4
SEG-C5
  Top 0.203: D5.4 33.96,73.66 35.23,74.93 35.23,86.98 36.2,87.95 36.2,93.73 35.56,94.37 U3.7
  Bottom 0.203: D5.4 33.96,68.58 32.69,67.31 32.69,53.34 33.96,52.07 D11.4 33.96,46.99 32.69,45.72 32.69,41.91 33.96,40.64 D17.4 33.96,26.67 32.69,25.4 32.69,11.43 33.96,10.16 D21.4
SEG-C6
  Top 0.203: D6.4 21.26,73.66 19.99,74.93 20,74.94 20,87 20.64,87.63 20.64,96.32 U3.15
  Bottom 0.203: D6.4 21.26,68.58 19.99,67.31 19.99,53.34 21.26,52.07 D12.4 21.26,46.99 19.99,45.72 19.99,41.91 21.26,40.64 D18.4 21.26,26.67 19.99,25.4 19.99,11.43 21.26,10.16 D22.4
SEG-D1
  Top 0.203: D1.2 89.84,73.66 88.57,74.93 88.57,87.33 87.31,88.58 87.31,93.66 86.68,94.3 85.41,94.3 84.69,95.02 U1.8
  Bottom 0.203: D13.2 89.84,40.64 88.57,41.91 88.57,45.72 89.84,46.99 D7.2 89.84,52.07 88.57,53.34 88.57,67.31 89.84,68.58 D1.2
SEG-D2
  Top 0.203: D2.2 77.14,73.66 73.33,77.47 73.33,95.67 U1.16
  Bottom 0.203: D14.2 77.14,40.64 75.87,41.91 75.87,45.72 77.14,46.99 D8.2 77.14,52.07 75.87,53.34 75.87,67.31 77.14,68.58 D2.2
SEG-D3
  Top 0.203: D3.2 64.44,73.66 63.17,74.93 63.18,74.94 63.18,87 61.59,88.58 61.59,94.61 61.19,95.02 U2.8 57.52,95.06
  Bottom 0.203: D3.2 64.44,68.58 63.17,67.31 63.17,53.34 64.44,52.07 D9.2 64.44,46.99 63.17,45.72 63.17,41.91 64.44,40.64 D15.2 64.44,26.67 63.17,25.4 63.17,11.43 64.44,10.16 D19.2
SEG-D4
  Top 0.203: D4.2 51.74,73.66 47.93,77.47 47.93,87.3 47.94,89.22 47.94,95.67 U2.16
  Bottom 0.203: D4.2 51.74,68.58 50.47,67.31 50.47,53.34 51.74,52.07 D10.2 51.74,46.99 50.47,45.72 50.47,41.91 51.74,40.64 D16.2 51.74,26.67 50.47,25.4 50.47,11.43 51.74,10.16 D20.2
SEG-D5
  Top 0.203: D5.2 39.04,73.66 37.77,74.93 37.77,87.26 36.83,87.95 36.83,94.3 36.07,95.06 31.84,95.06 U3.8
  Bottom 0.203: D5.2 39.04,69.85 37.77,68.58 37.77,53.34 39.04,52.07 D11.2 39.04,46.99 37.77,45.72 37.77,41.91 39.04,40.64 D17.2 39.04,26.67 37.77,25.4 37.77,11.43 39.04,10.16 D21.2
SEG-D6
  Top 0.203: D6.2 26.34,73.66 22.54,76.82 22.54,87.63 21.91,88.27 21.91,95.67 U3.16
  Bottom 0.203: D6.2 26.34,68.58 25.07,67.31 25.07,53.34 26.34,52.07 D12.2 26.34,46.99 25.07,45.72 25.07,41.91 26.34,40.64 D18.2 26.34,26.67 25.07,25.4 25.07,11.43 26.34,10.16 D22.2
SEG-E1  (via drill 0.3)
  Top 0.203: D1.1 92.38,73.66 91.11,74.93 91.11,87.33 88.58,89.85 88.58,93.98 86.93,95.63 v86.47,95.63 | U1.9 84.91,95.67 v84.95,95.63
  Bottom 0.203: D13.1 92.38,40.64 91.11,41.91 91.11,45.72 92.38,46.99 D7.1 92.38,52.07 91.11,53.34 91.11,67.31 92.38,68.58 D1.1 | v86.47,95.63 v84.95,95.63
SEG-E2
  Top 0.203: D2.1 79.68,73.66 75.87,77.47 75.88,85.72 75.88,87.63 73.98,87.63 73.98,95.02 U1.17
  Bottom 0.203: D14.1 79.68,40.64 78.41,41.91 78.41,45.72 79.68,46.99 D8.1 79.68,52.07 78.41,53.34 78.41,67.31 79.68,68.58 D2.1
SEG-E3  (via drill 0.3)
  Top 0.203: D3.1 66.98,73.66 65.71,74.93 65.71,87.01 62.87,89.85 62.87,95.45 v62.98,95.57 | U2.9 61.77,95.67 v61.59,95.57
  Bottom 0.203: D3.1 66.98,68.58 65.71,67.31 65.71,53.34 66.98,52.07 D9.1 66.98,46.99 65.71,45.72 65.71,41.91 66.98,40.64 D15.1 66.98,26.67 65.71,25.4 65.71,11.43 66.98,10.16 D19.1 | v62.98,95.57 v61.59,95.57
SEG-E4
  Top 0.203: D4.1 54.28,73.66 50.47,77.47 50.47,87.33 48.58,88.27 48.58,95.02 U2.17
  Bottom 0.203: D4.1 54.28,68.58 53.01,67.31 53.01,53.34 54.28,52.07 D10.1 54.28,46.99 53.01,45.72 53.01,41.91 54.28,40.64 D16.1 54.28,26.67 53.01,25.4 53.01,11.43 54.28,10.16 D20.1
SEG-E5  (via drill 0.3)
  Top 0.203: D5.1 41.58,73.66 40.31,74.93 40.31,87.33 38.42,88.58 v38.42,95.57 | v36.83,95.57 36.51,95.67 U3.9
  Bottom 0.203: D5.1 41.58,68.58 40.31,67.31 40.31,53.34 41.58,52.07 D11.1 41.58,46.99 40.31,45.72 40.31,41.91 41.58,40.64 D17.1 41.58,26.67 40.31,25.4 40.31,11.43 41.58,10.16 D21.1 | v38.42,95.57 v36.83,95.57
SEG-E6
  Top 0.203: D6.1 28.88,73.66 25.08,77.46 25.08,87 22.54,89.53 22.54,95.02 U3.17
  Bottom 0.203: D6.1 28.88,68.58 27.61,67.31 27.61,53.34 28.88,52.07 D12.1 28.88,46.99 27.61,45.72 27.61,41.91 28.88,40.64 D18.1 28.88,26.67 27.61,25.4 27.61,11.43 28.88,10.16 D22.1
SEG-F1
  Top 0.203: D1.9 89.85,85.74 89.85,87.31 87.95,89.22 87.95,93.66 86.68,94.93 86.04,94.93 85.72,95.25 85.72,95.89 85.29,96.32 U1.10
  Bottom 0.203: D13.9 89.84,45.72 91.11,46.99 91.11,52.07 89.84,53.34 D7.9 89.84,67.31 91.11,68.58 91.11,73.66 89.84,74.93 D1.9
SEG-F2
  Top 0.203: D2.9 77.14,88.27 74.61,88.27 74.61,94.37 U1.18
  Bottom 0.203: D14.9 77.14,45.72 78.41,46.99 78.41,52.07 77.14,53.34 D8.9 77.14,67.31 78.41,68.58 78.41,73.66 77.14,74.93 D2.9
SEG-F3
  Top 0.203: U2.10 62.22,96.32 62.22,89.23 64.45,87 64.45,85.74 D3.9
  Bottom 0.203: D19.9 64.44,25.4 65.71,26.67 65.71,40.64 64.44,41.91 D15.9 64.44,45.72 65.71,46.99 65.71,52.07 64.44,53.34 D9.9 64.44,67.31 65.71,68.58 65.71,73.66 64.44,74.93 D3.9
SEG-F4
  Top 0.203: D4.9 51.74,87.31 49.21,88.58 49.2,94.37 U2.18
  Bottom 0.203: D4.9 51.74,74.93 53.01,73.66 53.01,68.58 51.74,67.31 D10.9 51.74,53.34 53.01,52.07 53.01,46.99 51.74,45.72 D16.9 51.74,41.91 53.01,40.64 53.01,26.67 51.74,25.4 D20.9
SEG-F5
  Top 0.203: D5.9 39.04,87.31 37.62,88.27 37.62,96.32 U3.10
  Bottom 0.203: D5.9 39.04,74.93 40.31,73.66 40.31,68.58 39.04,67.31 D11.9 39.04,53.34 40.31,52.07 40.31,46.99 39.04,45.72 D17.9 39.04,41.91 40.31,40.64 40.31,26.67 39.04,25.4 D21.9
SEG-F6
  Top 0.203: D6.9 26.35,85.74 26.35,86.68 23.18,89.85 23.18,94.37 U3.18
  Bottom 0.203: D6.9 26.34,74.93 27.61,73.66 27.61,68.58 26.34,67.31 D12.9 26.34,53.34 27.61,52.07 27.61,46.99 26.34,45.72 D18.9 26.34,41.91 27.61,40.64 27.61,26.67 26.34,25.4 D22.9
SEG-G1
  Top 0.203: D1.10 92.38,87.01 89.22,90.17 89.22,93.98 86.23,96.97 U1.11
  Bottom 0.203: D13.10 92.38,45.72 93.65,46.99 93.65,52.07 92.38,53.34 D7.10 92.38,67.31 93.65,68.58 93.65,73.66 92.38,74.93 D1.10
SEG-G2
  Top 0.203: D2.10 79.68,86.87 79.24,87.31 78.42,87.31 77.79,87.95 77.79,88.9 75.25,88.9 75.25,93.72 U1.19
  Bottom 0.203: D14.10 79.68,45.72 80.95,46.99 80.95,52.07 79.68,53.34 D8.10 79.68,67.31 80.95,68.58 80.95,73.66 79.68,74.93 D2.10
SEG-G3
  Top 0.203: U2.11 63.18,96.97 63.82,96.33 63.82,95.25 63.5,94.93 63.5,90.17 66.98,86.69 D3.10
  Bottom 0.203: D19.10 66.98,25.4 68.25,26.67 68.25,40.64 66.98,41.91 D15.10 66.98,45.72 68.25,46.99 68.25,52.07 66.98,53.34 D9.10 66.98,67.31 68.25,68.58 68.25,73.66 66.98,74.93 D3.10
SEG-G4
  Top 0.203: U2.19 49.9,93.72 49.85,93.66 49.85,88.9 54.29,86.68 D4.10
  Bottom 0.203: D4.10 54.28,74.93 55.55,73.66 55.55,68.58 54.28,67.31 D10.10 54.28,53.34 55.55,52.07 55.55,46.99 54.28,45.72 D16.10 54.28,41.91 55.55,40.64 55.55,26.67 54.28,25.4 D20.10
SEG-G5
  Top 0.203: U3.11 39.05,96.97 39.05,88.9 40.01,88.27 40.96,88.27 41.59,87.63 41.59,86.69 | 41.59,86.69 41.58,86.68 | 41.59,86.69 41.59,85.74 D5.10
  Bottom 0.203: D5.10 41.58,74.93 42.85,73.66 42.85,68.58 41.58,67.31 D11.10 41.58,53.34 42.85,52.07 42.85,46.99 41.58,45.72 D17.10 41.58,41.91 42.85,40.64 42.85,26.67 41.58,25.4 D21.10
SEG-G6
  Top 0.203: D6.10 28.89,85.74 28.89,86.36 27.94,87.63 26.35,87.63 23.81,90.17 23.81,93.72 U3.19
  Bottom 0.203: D6.10 28.88,74.93 30.15,73.66 30.15,68.58 28.88,67.31 D12.10 28.88,53.34 30.15,52.07 30.15,46.99 28.88,45.72 D18.10 28.88,41.91 30.15,40.64 30.15,26.67 28.88,25.4 D22.10
SEG-P1  (via drill 0.3)
  Top 0.203: D1.5 82.22,73.66 83.49,74.93 83.49,86.98 v84.14,87.63 | v89.85,90.49 89.85,93.98 86.21,97.62 U1.12
  Bottom 0.203: D13.5 82.22,40.64 80.95,41.91 80.95,45.72 82.22,46.99 D7.5 82.22,52.07 80.95,53.34 80.95,67.31 82.22,68.58 D1.5 | v89.85,90.49 89.85,88.27 89.22,87.63 v84.14,87.63
SEG-P2  (via drill 0.3)
  Top 0.203: D2.5 69.52,73.66 68.25,74.93 68.25,86.67 70.8,89.22 v70.8,93.03 | 77.5,93.07 U1.20 76.56,93.07 v76.2,93.03
  Bottom 0.203: D14.5 69.52,40.64 68.25,41.91 68.25,45.72 69.52,46.99 D8.5 69.52,52.07 68.25,53.34 68.25,67.31 69.52,68.58 D2.5 | v70.8,93.03 v76.2,93.03
SEG-P3  (via drill 0.3)
  Top 0.203: D3.5 56.82,73.66 58.09,74.93 v58.09,87.06 | U2.12 64.45,97.62 64.45,90.17 v66.99,87.63
  Bottom 0.203: D3.5 56.82,68.58 55.55,67.31 55.55,53.34 56.82,52.07 D9.5 56.82,46.99 55.55,45.72 55.55,41.91 56.82,40.64 D15.5 56.82,26.67 55.55,25.4 55.55,21.89 54.29,20.64 54.29,19.68 55.56,18.41 55.56,11.44 55.55,11.43 56.82,10.16 D19.5 | v66.99,87.63 58.66,87.63 v58.09,87.06
SEG-P4  (via drill 0.3)
  Top 0.203: D4.5 44.12,73.66 42.85,74.93 42.85,87.3 44.77,89.22 v44.77,93.03 | U2.20 50.77,93.07 v50.48,93.03
  Bottom 0.203: D4.5 44.12,68.58 42.85,67.31 42.85,53.34 44.12,52.07 D10.5 44.12,46.99 42.85,45.72 42.85,41.91 44.12,40.64 D16.5 44.12,26.67 42.85,25.4 42.85,11.43 44.12,10.16 D20.5 | v44.77,93.03 v50.48,93.03
SEG-P5  (via drill 0.3)
  Top 0.203: D5.5 31.42,73.66 32.69,74.93 32.69,86.35 v32.7,86.68 | U3.12 39.69,97.62 39.69,89.22 40.01,88.9 41.59,88.9 v42.23,88.27
  Bottom 0.203: D5.5 31.42,68.58 30.15,67.31 30.15,53.34 31.42,52.07 D11.5 31.42,46.99 30.15,45.72 30.15,41.91 31.42,40.64 D17.5 31.42,26.67 30.15,25.4 30.15,11.43 31.42,10.16 D21.5 | v42.23,88.27 41.59,87.63 33.66,87.63 v32.7,86.68
SEG-P6  (via drill 0.3)
  Top 0.203: D6.5 18.72,73.66 17.45,74.93 17.45,86.98 19.05,88.58 v19.05,93.03 | U3.20 25.12,93.07 v25.08,93.03
  Bottom 0.203: D6.5 18.72,68.58 17.45,67.31 17.45,53.34 18.72,52.07 D12.5 18.72,46.99 17.45,45.72 17.45,41.91 18.72,40.64 D18.5 18.72,26.67 17.45,25.4 17.45,11.43 18.72,10.16 D22.5 | v19.05,93.03 v25.08,93.03
VCC
  pour Bottom: 77.15,90.49 77.15,87.63 16.19,87.63 16.19,90.49
~MCLR  (2 unrouted)

### Text on the board
bPlace: Time | Diff | Hz | Volt